# EAGLE design Board (EAGLE 7.7.0)

## Sheet 1 of 7: Rubidium
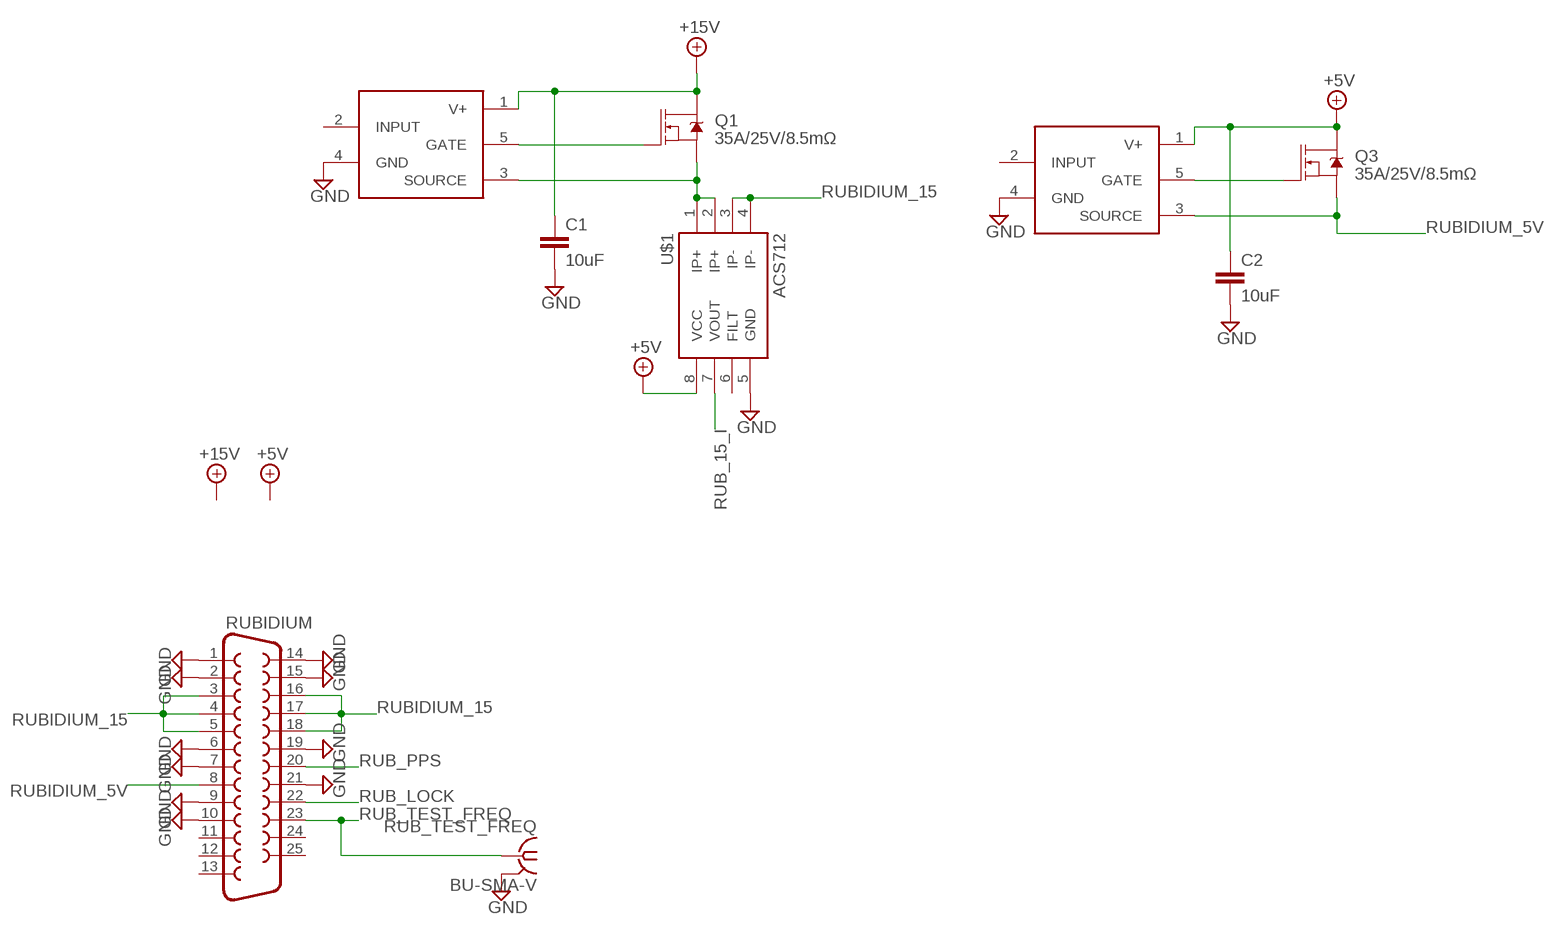
[diagram p0: schematic, sheet 1]

### Parts
C1  10uF  C-EUC1206  [C1206]
C2  10uF  C-EUC1206  [C1206]
Q1  35A/25V/8.5mΩ  MOSFET-NCH-FDD8780  [DPAK]
Q3  35A/25V/8.5mΩ  MOSFET-NCH-FDD8780  [DPAK]
RUB_TEST_FREQ  BU-SMA-V  [BU-SMA-V]
RUBIDIUM  F25VP  [F25VP]
U$1  ACS712  [SO08]
U$3  MIC5014  [SOIC8]
U$4  MIC5014  [SOIC8]

### Nets
+5V: C2.1 Q3.4(D) U$1.8(VCC) U$4.1(V+) ; also sheet 2,3,5,6,7
+15V: C1.1 Q1.4(D) U$3.1(V+) ; also sheet 2
GND: C1.2 C2.2 RUB_TEST_FREQ.2 RUB_TEST_FREQ.3 RUB_TEST_FREQ.4 RUB_TEST_FREQ.5 RUBIDIUM.1 RUBIDIUM.2 RUBIDIUM.6 RUBIDIUM.7 RUBIDIUM.9 RUBIDIUM.10 RUBIDIUM.14 RUBIDIUM.15 RUBIDIUM.19 RUBIDIUM.21 U$1.5(GND) U$3.4(GND) U$4.4(GND) ; also sheet 2,3,5,6,7
N$1: Q1.3(S) U$1.1(IP+) U$1.2(IP+) U$3.3(SOURCE)
N$2: Q3.1(G) U$4.5(GATE)
N$5: Q1.1(G) U$3.5(GATE)
RUB_15_I: U$1.7(VOUT)
RUB_LOCK: RUBIDIUM.22
RUB_PPS: RUBIDIUM.20 ; also sheet 3
RUB_TEST_FREQ: RUB_TEST_FREQ.1 RUBIDIUM.23
RUBIDIUM_5V: Q3.3(S) RUBIDIUM.8 U$4.3(SOURCE)
RUBIDIUM_15: RUBIDIUM.3 RUBIDIUM.4 RUBIDIUM.5 RUBIDIUM.16 RUBIDIUM.17 RUBIDIUM.18 U$1.3(IP-) U$1.4(IP-)
Unconnected: RUBIDIUM.11 RUBIDIUM.12 RUBIDIUM.13 RUBIDIUM.24 RUBIDIUM.25 U$1.6(FILT) U$3.2(INPUT) U$4.2(INPUT)

## Sheet 2 of 7: Power
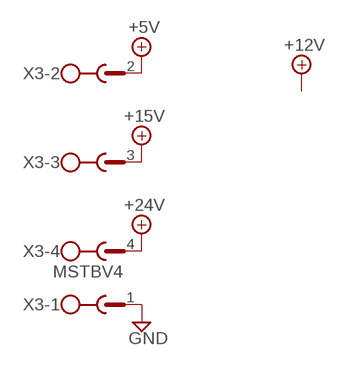
[diagram p1: schematic, sheet 2]

### Parts
X3  MSTBV4  [MSTBV4]

### Nets
+5V: X3.2 ; also sheet 1,3,5,6,7
+15V: X3.3 ; also sheet 1
+24V: X3.4 ; also sheet 5
GND: X3.1 ; also sheet 1,3,5,6,7

## Sheet 3 of 7: PPS PPS Management
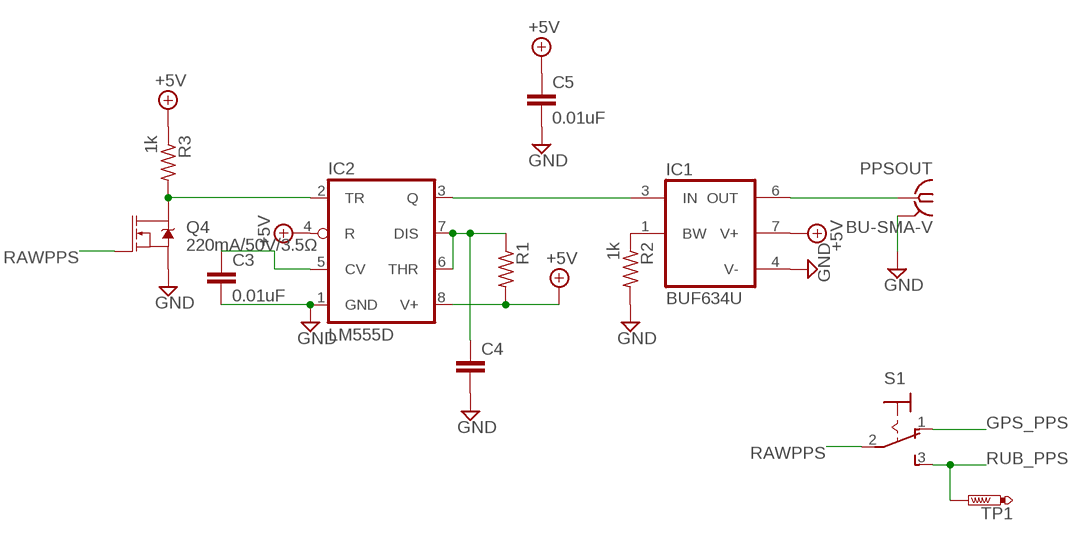
[diagram p2: schematic, sheet 3]

### Parts
C3  0.01uF  C-EUC1206  [C1206]
C4  C-EUC1206  [C1206]
C5  0.01uF  C-EUC1206  [C1206]
IC1  BUF634U  [SO08]
IC2  LM555D  [SO08]
PPSOUT  BU-SMA-V  [BU-SMA-V]
Q4  220mA/50V/3.5Ω  MOSFET-NCH-BSS138  [SOT23-3]
R1  R-US_R1206  [R1206]
R2  1k  R-US_R1206  [R1206]
R3  1k  R-US_R1206  [R1206]
S1  M9040P  [M9040P]
TP1  PTR1PAD1-13  [P1-13]

### Nets
+5V: C5.1 IC1.7(V+) IC2.4(R) IC2.8(V+) R1.2 R3.1 ; also sheet 1,2,5,6,7
GND: C3.2 C4.2 C5.2 IC1.4(V-) IC2.1(GND) PPSOUT.2 PPSOUT.3 PPSOUT.4 PPSOUT.5 Q4.2(S) R2.2 ; also sheet 1,2,5,6,7
GPS_PPS: S1.1(O)
N$3: IC1.6(OUT) PPSOUT.1
N$4: IC1.3(IN) IC2.3(Q)
N$6: C4.1 IC2.6(THR) IC2.7(DIS) R1.1
N$7: C3.1 IC2.5(CV)
N$8: IC1.1(BW) R2.1
N$11: IC2.2(TR) Q4.3(D) R3.2
RAWPPS: Q4.1(G) S1.2(P)
RUB_PPS: S1.3(S) TP1.TP ; also sheet 1

## Sheet 4 of 7: GPS
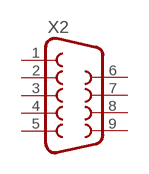
[diagram p3: schematic, sheet 4]

### Parts
X2  F09VP  [F09VP]
Unconnected: X2.1 X2.2 X2.3 X2.4 X2.5 X2.6 X2.7 X2.8 X2.9

## Sheet 5 of 7: Crystal
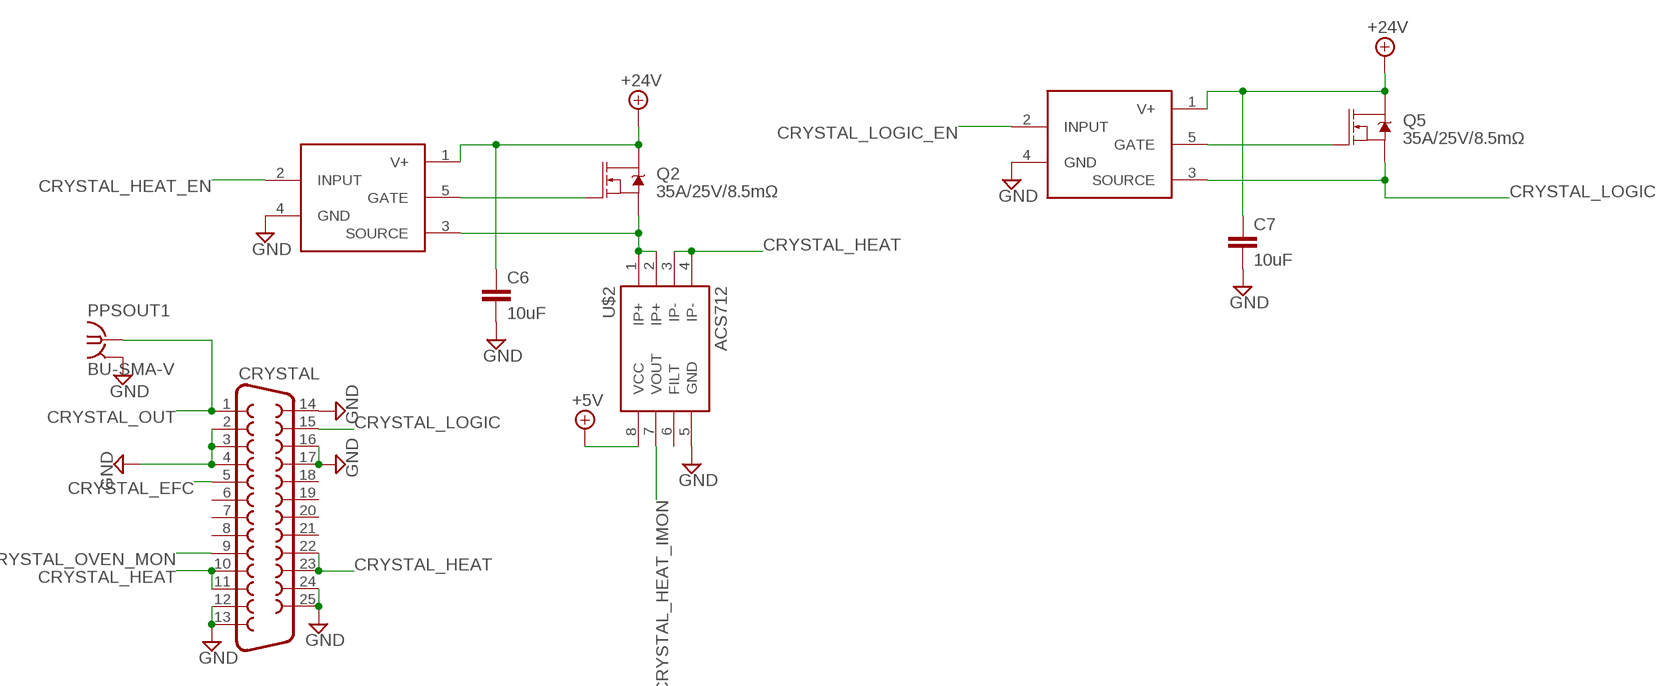
[diagram p4: schematic, sheet 5]

### Parts
C6  10uF  C-EUC1206  [C1206]
C7  10uF  C-EUC1206  [C1206]
CRYSTAL  F25VP  [F25VP]
PPSOUT1  BU-SMA-V  [BU-SMA-V]
Q2  35A/25V/8.5mΩ  MOSFET-NCH-FDD8780  [DPAK]
Q5  35A/25V/8.5mΩ  MOSFET-NCH-FDD8780  [DPAK]
U$2  ACS712  [SO08]
U$5  MIC5014  [SOIC8]
U$8  MIC5014  [SOIC8]

### Nets
+5V: U$2.8(VCC) ; also sheet 1,2,3,6,7
+24V: C6.1 C7.1 Q2.4(D) Q5.4(D) U$5.1(V+) U$8.1(V+) ; also sheet 2
CRYSTAL_EFC: CRYSTAL.5
CRYSTAL_HEAT: CRYSTAL.10 CRYSTAL.11 CRYSTAL.22 CRYSTAL.23 U$2.3(IP-) U$2.4(IP-)
CRYSTAL_HEAT_EN: U$5.2(INPUT)
CRYSTAL_HEAT_IMON: U$2.7(VOUT)
CRYSTAL_LOGIC: CRYSTAL.15 Q5.3(S) U$8.3(SOURCE)
CRYSTAL_LOGIC_EN: U$8.2(INPUT)
CRYSTAL_OUT: CRYSTAL.1 PPSOUT1.1
CRYSTAL_OVEN_MON: CRYSTAL.9
GND: C6.2 C7.2 CRYSTAL.2 CRYSTAL.3 CRYSTAL.4 CRYSTAL.12 CRYSTAL.13 CRYSTAL.14 CRYSTAL.16 CRYSTAL.17 CRYSTAL.24 CRYSTAL.25 PPSOUT1.2 PPSOUT1.3 PPSOUT1.4 PPSOUT1.5 U$2.5(GND) U$5.4(GND) U$8.4(GND) ; also sheet 1,2,3,6,7
N$9: Q2.3(S) U$2.1(IP+) U$2.2(IP+) U$5.3(SOURCE)
N$10: Q2.1(G) U$5.5(GATE)
N$14: Q5.1(G) U$8.5(GATE)
Unconnected: CRYSTAL.6 CRYSTAL.7 CRYSTAL.8 CRYSTAL.18 CRYSTAL.19 CRYSTAL.20 CRYSTAL.21 U$2.6(FILT)

## Sheet 6 of 7: Microcontroller
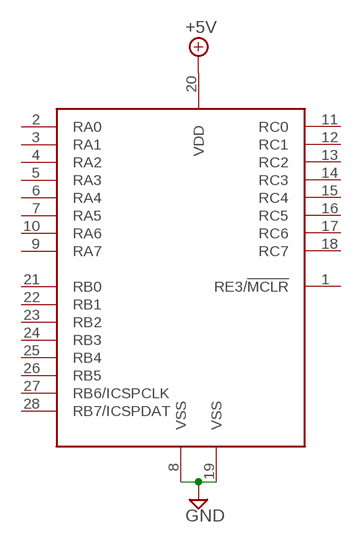
[diagram p5: schematic, sheet 6]

### Parts
U$6  PIC18F25K42SOIC  [SO28W]

### Nets
+5V: U$6.20(VDD) ; also sheet 1,2,3,5,7
GND: U$6.8(VSS) U$6.19(VSS) ; also sheet 1,2,3,5,7
Unconnected: U$6.1(RE3/!MCLR) U$6.2(RA0) U$6.3(RA1) U$6.4(RA2) U$6.5(RA3) U$6.6(RA4) U$6.7(RA5) U$6.9(RA7) U$6.10(RA6) U$6.11(RC0) U$6.12(RC1) U$6.13(RC2) U$6.14(RC3) U$6.15(RC4) U$6.16(RC5) U$6.17(RC6) U$6.18(RC7) U$6.21(RB0) U$6.22(RB1) U$6.23(RB2) U$6.24(RB3) U$6.25(RB4) U$6.26(RB5) U$6.27(RB6/ICSPCLK) U$6.28(RB7/ICSPDAT)

## Sheet 7 of 7: Raspberry Pi
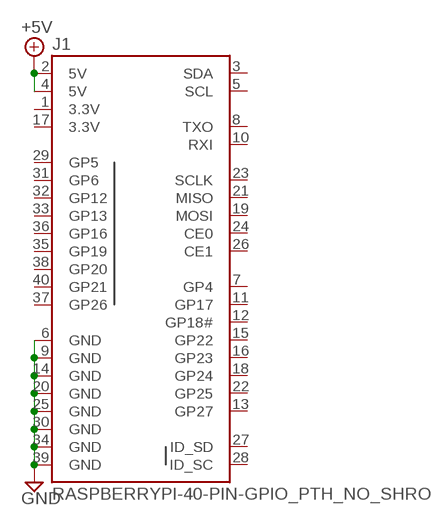
[diagram p6: schematic, sheet 7]

### Parts
J1  RASPBERRYPI-40-PIN-GPIO_PTH_NO_SHROUD  [2X20]

### Nets
+5V: J1.2(5V) J1.4(5V) ; also sheet 1,2,3,5,6
GND: J1.6(GND) J1.9(GND) J1.14(GND) J1.20(GND) J1.25(GND) J1.30(GND) J1.34(GND) J1.39(GND) ; also sheet 1,2,3,5,6
Unconnected: J1.3(SDA) J1.5(SCL) J1.7(GP4) J1.8(TXO) J1.10(RXI) J1.11(GP17) J1.12(GP18#) J1.13(GP27) J1.15(GP22) J1.16(GP23) J1.18(GP24) J1.19(MOSI) J1.21(MISO) J1.22(GP25) J1.23(SCLK) J1.24(CE0) J1.26(CE1) J1.27(ID_SD) J1.28(ID_SC) J1.29(GP5) J1.31(GP6) J1.32(GP12) J1.33(GP13) J1.35(GP19) J1.36(GP16) J1.37(GP26) J1.38(GP20) J1.40(GP21)

## Power pins joined to a net without a drawn wire
3.3V: J1.1(3.3V) J1.17(3.3V)

## Library data of the parts
C1-C7 = resistor:C-EU: CAPACITOR, European symbol
CRYSTAL RUBIDIUM = con-subd:F25: SUB-D; OC_FARNELL: unknown; OC_NEWARK: unknown
IC1 = burr-brown:BUF634: 250mA High-Speed Buffer; MF: TEXAS INSTRUMENTS; MPN: BUF634U; OC_FARNELL: 4733617; OC_NEWARK: 27C6567
IC2 = linear:*555: TIMER
J1 = SparkFun-Connectors:RASPBERRYPI-40-PIN-GPIO: Raspberry Pi GPIO Header 2x20 pin connector, as found on B, B+, A+ models. Both shrouded PTH and SMT versions available. SparkFun Products: GPIO Shrouded Header <https://www.sparkfun.com/products/13054>- PTH SparkFun Pi Wedge (Preassembled) <https://www.sparkfun.com/products/13717>
PPSOUT PPSOUT1 RUB_TEST_FREQ = con-coax:BU-SMA-V: FEMALE SMA CONNECTOR Radiall distributor RS 112-3794; OC_FARNELL: unknown; OC_NEWARK: unknown
Q1-Q3 Q5 = SparkFun-DiscreteSemi:MOSFET-NCH: N-channel MOSFETs Voltage controlled devices that allow control of high current outputs. SparkFun Products: SparkFun OpenScale <https://www.sparkfun.com/products/13261> SparkFun Digital Sandbox <https://www.sparkfun.com/products/12651> SparkFun Monster Moto Shield <https://www.sparkfun.com/products/10182> SparkFun MOSFET Power Controller <https://www.sparkfun.com/products/11214>; PROD_ID: TRANS-09984
Q4 = SparkFun-DiscreteSemi:MOSFET-NCH: N-channel MOSFETs Voltage controlled devices that allow control of high current outputs. SparkFun Products: SparkFun OpenScale <https://www.sparkfun.com/products/13261> SparkFun Digital Sandbox <https://www.sparkfun.com/products/12651> SparkFun Monster Moto Shield <https://www.sparkfun.com/products/10182> SparkFun MOSFET Power Controller <https://www.sparkfun.com/products/11214>; PROD_ID: TRANS-00830
R1-R3 = resistor:R-US_: RESISTOR, American symbol
S1 = switch:M9040P: TOGGLE SWITCH Marquardt
TP1 = testpad:PTR1: TEST PIN
U$1 U$2 = SparkFun-Sensors:ACS712: ACS712 Hall-effect-based isolated linear current sensor Datasheet <http://www.sparkfun.com/datasheets/BreakoutBoards/0712.pdf> SparkFun Products SparkFun Low Current Sensor Breakout - ACS712 <https://www.sparkfun.com/products/8883> (SEN-08883); PROD_ID: IC-08964
U$3-U$5 U$8 = FRC696:MIC5014
U$6 = FRC696:PIC18F25K42
X2 = con-subd:F09: SUB-D; OC_FARNELL: unknown; OC_NEWARK: unknown
X3 = con-phoenix-508:MSTBV4: PHOENIX; MPN: MSTBV 2,5/4-GF-5.08; OC_FARNELL: 1792794; OC_NEWARK: 69R9847

## Board
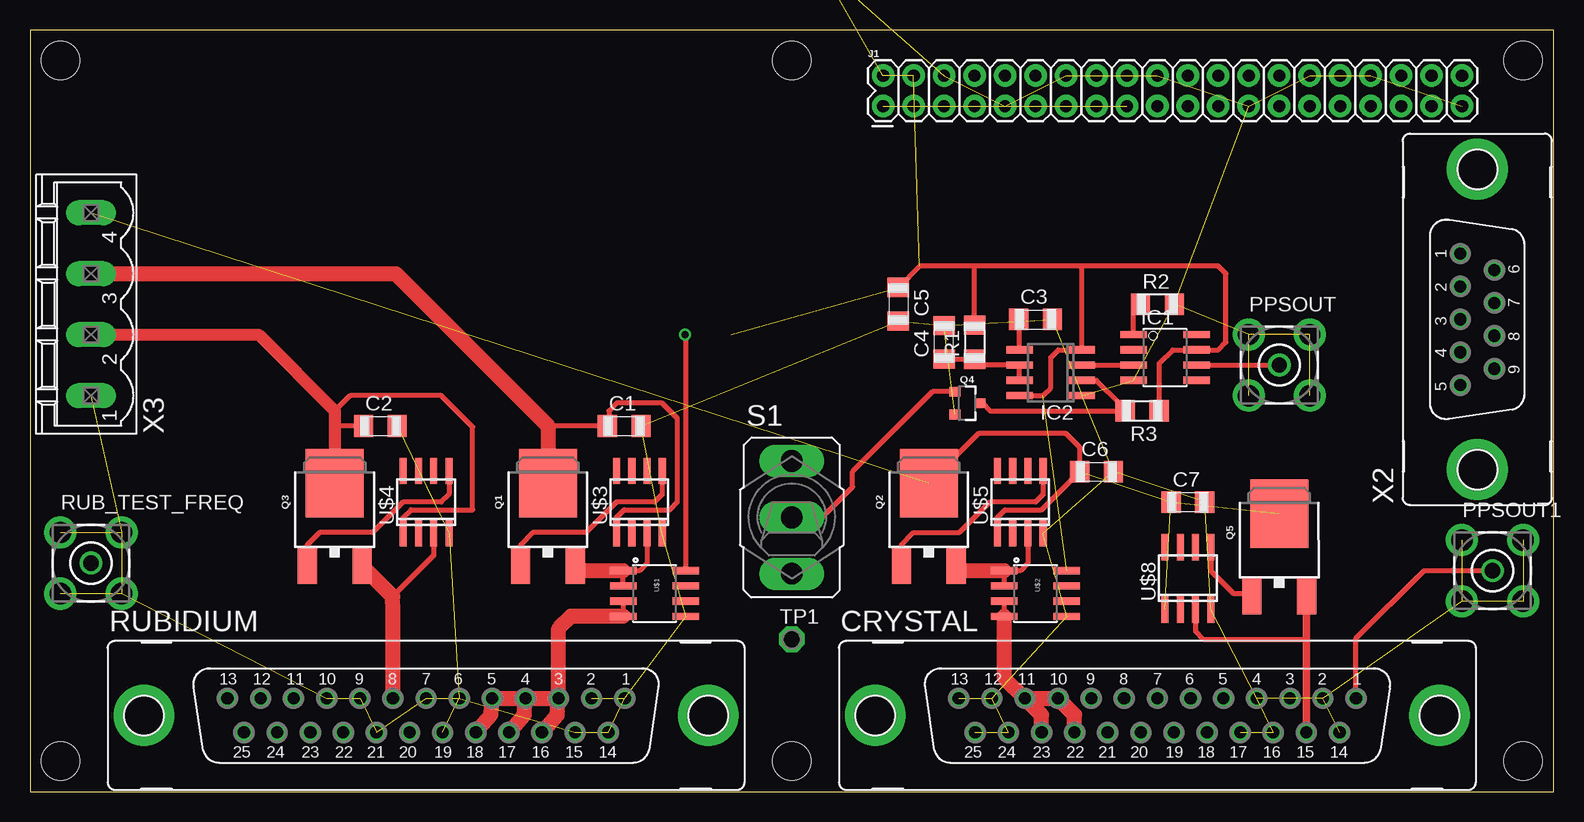
[diagram p7: board, top side]
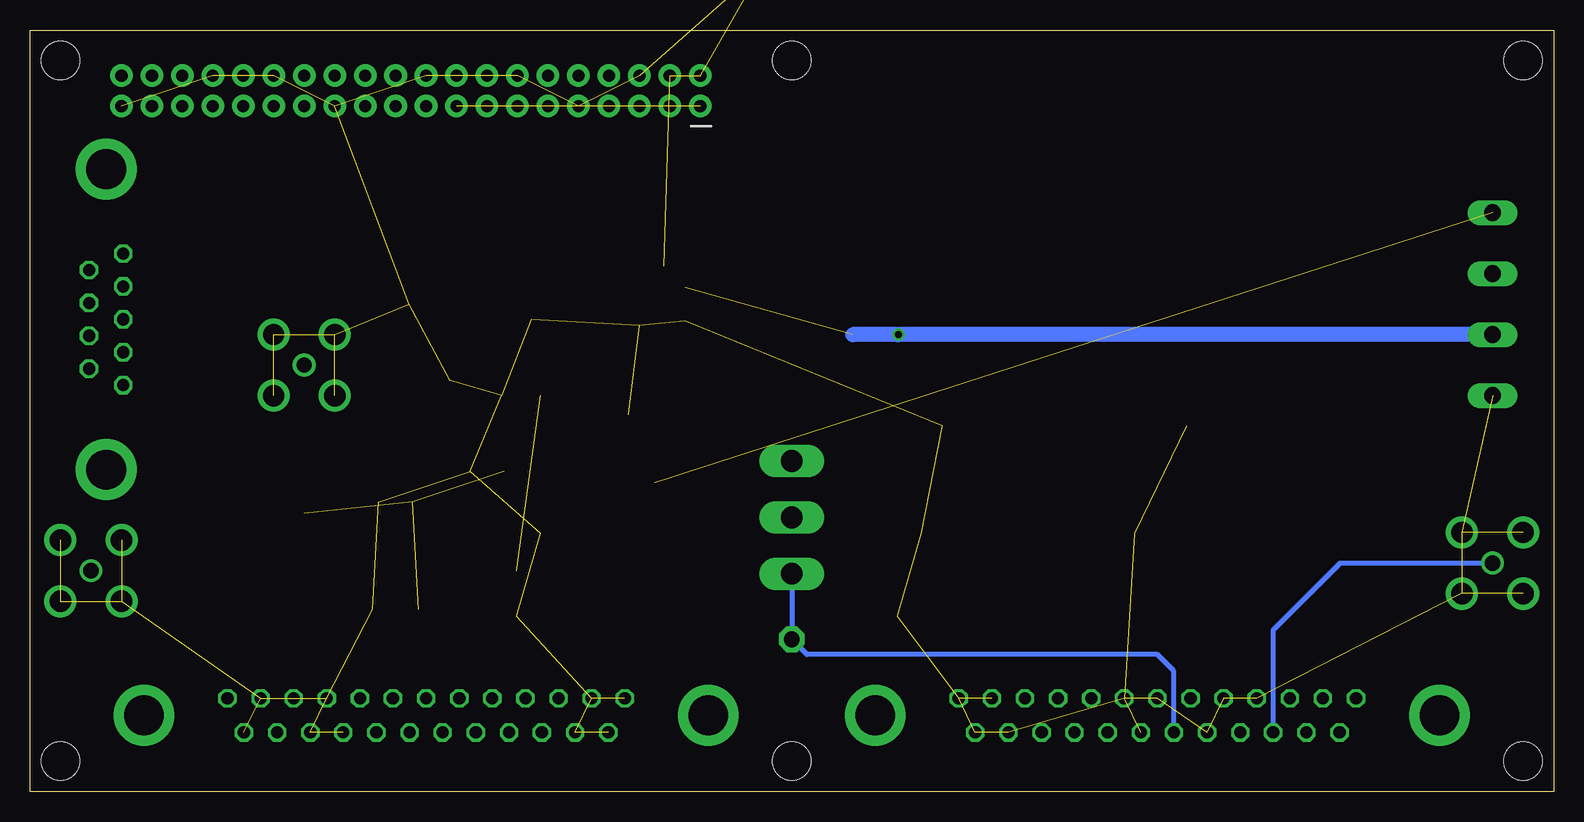
[diagram p8: board, bottom side, seen from below]

Size 127 x 63.5 mm. Coordinates in mm from the lower left corner, seen from the top.
Outline: 0,0 127,0 127,63.5 0,63.5 0,0
Copper layers (1*16): Top 0.035mm / dielectric 1.5mm / Bottom 0.035mm
Design rules "default": minimum track width 10mil, minimum drill 24mil, track to track 8mil, track to pad 8mil, pad to pad 8mil, via to via 8mil, smd to smd 8mil, copper to edge 40mil, drill to drill 8mil, minimum pad ring 10mil, minimum via ring 8mil, stop-mask expansion 4mil, vias tented up to drill 0mil, thermal gap 10mil
Holes 3.2 mm at 2.54,2.54 2.54,60.96 124.46,2.54 124.46,60.96 63.5,2.54 63.5,60.96

### Footprints (pad centres in the part's own frame; a part is rotated, then mirrored left to right if it is on the bottom)
C1206 = smd 1.6 x 1.8: 1 -1.4,0; 2 1.4,0
F25VP = drill 1.016 octagon: 1 16.561,1.422; 2 13.792,1.422; 3 11.049,1.422; 4 8.28,1.422; 5 5.512,1.422; 6 2.769,1.422; 7 0,1.422; 8 -2.769,1.422; 9 -5.512,1.422; 10 -8.28,1.422; 11 -11.049,1.422; 12 -13.792,1.422; 13 -16.561,1.422; 14 15.189,-1.422; 15 12.421,-1.422; 16 9.652,-1.422; 17 6.909,-1.422; 18 4.14,-1.422; 19 1.372,-1.422; 20 -1.372,-1.422; 21 -4.14,-1.422; 22 -6.909,-1.422; 23 -9.652,-1.422; 24 -12.421,-1.422; 25 -15.189,-1.422 | drill 3.302 pad 5.08: G1 -23.52,0; G2 23.52,0
SO08 = smd 0.61 x 2.21: 1 -1.905,-2.616; 2 -0.635,-2.616; 3 0.635,-2.616; 4 1.905,-2.616; 5 1.905,2.616; 6 0.635,2.616; 7 -0.635,2.616; 8 -1.905,2.616
SO08' = smd 0.6 x 2.2: 1 -1.905,-2.6; 2 -0.635,-2.6; 3 0.635,-2.6; 4 1.905,-2.6; 5 1.905,2.6; 6 0.635,2.6; 7 -0.635,2.6; 8 -1.905,2.6
2X20 = drill 1.016 pad 1.88: 1 0,0; 2 0,2.54; 3 2.54,0; 4 2.54,2.54; 5 5.08,0; 6 5.08,2.54; 7 7.62,0; 8 7.62,2.54; 9 10.16,0; 10 10.16,2.54; 11 12.7,0; 12 12.7,2.54; 13 15.24,0; 14 15.24,2.54; 15 17.78,0; 16 17.78,2.54; 17 20.32,0; 18 20.32,2.54; 19 22.86,0; 20 22.86,2.54; 21 25.4,0; 22 25.4,2.54; 23 27.94,0; 24 27.94,2.54; 25 30.48,0; 26 30.48,2.54; 27 33.02,0; 28 33.02,2.54; 29 35.56,0; 30 35.56,2.54; 31 38.1,0; 32 38.1,2.54; 33 40.64,0; 34 40.64,2.54; 35 43.18,0; 36 43.18,2.54; 37 45.72,0; 38 45.72,2.54; 39 48.26,0; 40 48.26,2.54
BU-SMA-V = drill 1.27: 1 0,0 | drill 1.778: 2 -2.55,2.55; 3 2.55,2.55; 4 2.55,-2.55; 5 -2.55,-2.55
DPAK = smd 1.6 x 3: 1 -2.28,-5.31; 3 2.28,-5.31 | smd 4.826 x 5.715: 4 0,1.588
SOT23-3 = smd 0.8 x 0.9: 1 -0.95,-1; 2 0.95,-1; 3 0,1.1
R1206 = smd 1.6 x 1.803: 1 -1.422,0; 2 1.422,0
M9040P = drill 1.803 long: 1 0,4.699; 2 0,0; 3 0,-4.699
P1-13 = drill 1.321 pad 2.159 octagon: TP 0,0
SOIC8 = smd 0.6 x 2.2: 1 -1.905,-2.6; 2 -0.635,-2.6; 3 0.635,-2.6; 4 1.905,-2.6; 5 1.905,2.6; 6 0.635,2.6; 7 -0.635,2.6; 8 -1.905,2.6
SO28W = smd 0.6 x 2.2: 1 -8.255,-4.6; 2 -6.985,-4.6; 3 -5.715,-4.6; 4 -4.445,-4.6; 5 -3.175,-4.6; 6 -1.905,-4.6; 7 -0.635,-4.6; 8 0.635,-4.6; 9 1.905,-4.6; 10 3.175,-4.6; 11 4.445,-4.6; 12 5.715,-4.6; 13 6.985,-4.6; 14 8.255,-4.6; 15 8.255,4.6; 16 6.985,4.6; 17 5.715,4.6; 18 4.445,4.6; 19 3.175,4.6; 20 1.905,4.6; 21 0.635,4.6; 22 -0.635,4.6; 23 -1.905,4.6; 24 -3.175,4.6; 25 -4.445,4.6; 26 -5.715,4.6; 27 -6.985,4.6; 28 -8.255,4.6
F09VP = drill 1.016 octagon: 1 5.486,1.422; 2 2.743,1.422; 3 0,1.422; 4 -2.743,1.422; 5 -5.486,1.422; 6 4.115,-1.422; 7 1.372,-1.422; 8 -1.372,-1.422; 9 -4.115,-1.422 | drill 3.302 pad 5.08: G1 -12.522,0; G2 12.522,0
MSTBV4 = drill 1.397 long: 1 -7.62,0; 2 -2.54,0; 3 2.54,0; 4 7.62,0

### Placement (x,y rotation side)
C1  49.53,30.48 0 top
C2  29.21,30.48 0 top
C3  83.82,39.37 0 top
C4  76.2,37.47 90 top
C5  72.39,40.64 270 top
C6  88.9,26.67 0 top
C7  96.52,24.13 0 top
CRYSTAL  93.98,6.35 0 top
IC1  94.61,36.2 270 top
IC2  LM555D  [SO08']  85.09,34.92 90 top
J1  71.12,57.15 0 top
PPSOUT  104.14,35.56 0 top
PPSOUT1  121.92,18.41 0 top
Q1  43.18,24.13 0 top
Q2  74.93,24.13 0 top
Q3  25.4,24.13 0 top
Q4  78.11,32.38 270 top
Q5  104.14,21.59 0 top
R1  78.74,37.47 90 top
R2  93.98,40.64 0 top
R3  92.71,31.75 180 top
RUB_TEST_FREQ  5.08,19.05 0 top
RUBIDIUM  33.02,6.35 0 top
S1  63.5,22.86 0 top
TP1  63.5,12.7 0 top
U$1  52.07,16.51 270 top
U$2  83.82,16.51 270 top
U$3  50.8,24.13 0 top
U$4  33.02,24.13 0 top
U$5  82.55,24.13 0 top
U$6  52.07,85.09 0 top  (outside the outline)
U$8  96.52,17.78 0 top
X2  120.65,39.37 90 top
X3  5.08,40.64 90 top

### Tracks (layer width: path | path; a pad name or v marks a point on that pad's centre or on a via)
3.3V  (1 unrouted)
+5V  (via drill 0.6)  (5 unrouted)
  Top 0.406: C2.1 25.4,30.48 | 25.4,31.75 26.67,33.02 34.29,33.02 36.91,30.4 36.91,23.5 31.75,23.5 31.11,22.86 U$4.1 | U$1.8 54.69,38.02 v54.61,38.1 | 87.63,43.81 99.06,43.81 99.69,43.18 99.69,37.47 99.06,36.83 IC1.7 95.25,36.83 94.13,35.71 R3.1 | 87.63,43.81 78.74,43.81 | 78.74,43.81 74.17,43.81 C5.1 | R1.2 78.74,43.81 | IC2.8 84.45,33.02 85.09,33.66 85.09,36.2 85.72,36.83 IC2.4 87.69,43.76 87.63,43.81
  Top 1.016: X3.2 19.05,38.1 25.4,31.75 25.4,30.48 Q3.4
  Bottom 1.27: X3.2 v54.61,38.1 58.42,38.1
+15V
  Top 0.406: 43.18,30.48 C1.1 48.26,30.61 48.26,31.75 48.9,32.38 52.7,32.38 53.98,31.11 53.98,24.13 53.34,23.5 49.53,23.5 48.9,22.86 U$3.1
  Top 1.27: X3.3 30.48,43.18 43.18,30.48 Q1.4
+24V  (4 unrouted)
  Top 0.406: U$5.1 80.64,22.86 81.28,23.5 84.33,23.5 C6.1 87.5,28.7 86.36,29.84 79.06,29.84 Q2.4
CRYSTAL_HEAT
  Top 0.406: U$2.3 U$2.4
  Top 1.27: U$2.4 81.2,9.5 CRYSTAL.11 | CRYSTAL.11 CRYSTAL.10 87.07,6.4 CRYSTAL.22 | CRYSTAL.23 84.33,6.38 CRYSTAL.11
CRYSTAL_LOGIC
  Top 0.406: U$8.3 97.16,13.34 97.79,12.7 106.4,12.7
  Top 0.61: CRYSTAL.15 106.4,12.7 106.4,16.26 Q5.3
CRYSTAL_OUT
  Top 0.406: CRYSTAL.1 110.54,12.75 116.2,18.41 PPSOUT1.1
GND  (59 unrouted)
N$1
  Top 0.406: U$1.2 U$1.1 50.8,18.41 51.44,19.05 U$3.3
  Top 1.27: U$1.1 45.87,18.41 Q1.3
N$2
  Top 0.406: U$4.5 34.92,24.77 34.29,24.13 31.11,24.13 28.57,21.59 24.13,21.59 23.12,20.58 Q3.1
N$3
  Top 0.406: IC1.6 PPSOUT.1
N$4
  Top 0.406: IC2.3 IC1.3
N$5
  Top 0.406: Q1.1 40.9,20.58 41.91,21.59 46.35,21.59 48.9,24.13 52.07,24.13 52.7,24.77 U$3.5
N$6
  Top 0.406: IC2.7 IC2.6 79.22,35.56 R1.1 78.72,36.06 C4.1
N$7
  Top 0.406: IC2.5 82.49,39.3 C3.1
N$8
  Top 0.406: IC1.1 92,40.08 R2.1
N$9
  Top 0.406: U$2.2 U$2.1 82.55,18.41 83.19,19.05 U$5.3
  Top 1.27: U$2.1 77.61,18.41 Q2.3
N$10
  Top 0.406: U$5.5 84.45,24.77 83.82,24.13 80.01,24.13 77.47,21.59 73.66,21.59 72.65,20.58 Q2.1
N$11
  Top 0.406: Q4.3 79.38,32.38 80.01,31.75 R3.2 90.81,32.23 90.81,32.38 88.9,34.29 IC2.2
N$14
  Top 0.406: U$8.5 98.42,18.41 100.33,16.51 101.63,16.51 Q5.1
RAWPPS
  Top 0.406: S1.2 66.04,22.86 68.58,25.4 68.58,26.67 75.25,33.34 Q4.1
RUB_PPS
  Bottom 0.406: RUBIDIUM.20 31.65,10.06 33.02,11.43 62.23,11.43 TP1.TP S1.3
RUB_TEST_FREQ
  Bottom 0.406: RUBIDIUM.23 23.37,13.46 17.78,19.05 RUB_TEST_FREQ.1
RUBIDIUM_5V
  Top 0.406: U$4.3 33.66,19.68 30.23,16.27
  Top 1.27: RUBIDIUM.8 30.25,14.98 30.23,16.27 Q3.3
RUBIDIUM_15
  Top 0.406: U$1.3 U$1.4
  Top 1.27: RUBIDIUM.18 38.43,6.4 RUBIDIUM.5 RUBIDIUM.4 | RUBIDIUM.4 RUBIDIUM.3 | RUBIDIUM.17 41.2,6.4 RUBIDIUM.4 | RUBIDIUM.16 43.94,6.38 RUBIDIUM.3 | U$1.4 45.09,14.61 44.07,13.59 RUBIDIUM.3